# Altium schematic sheet DC_DC.SchDoc
size A3; Organization: Altium Limited; Address1: L3, 12a Rodborough Rd; Address2: Frenchs Forest; Address3: NSW; Address4: Australia 2086
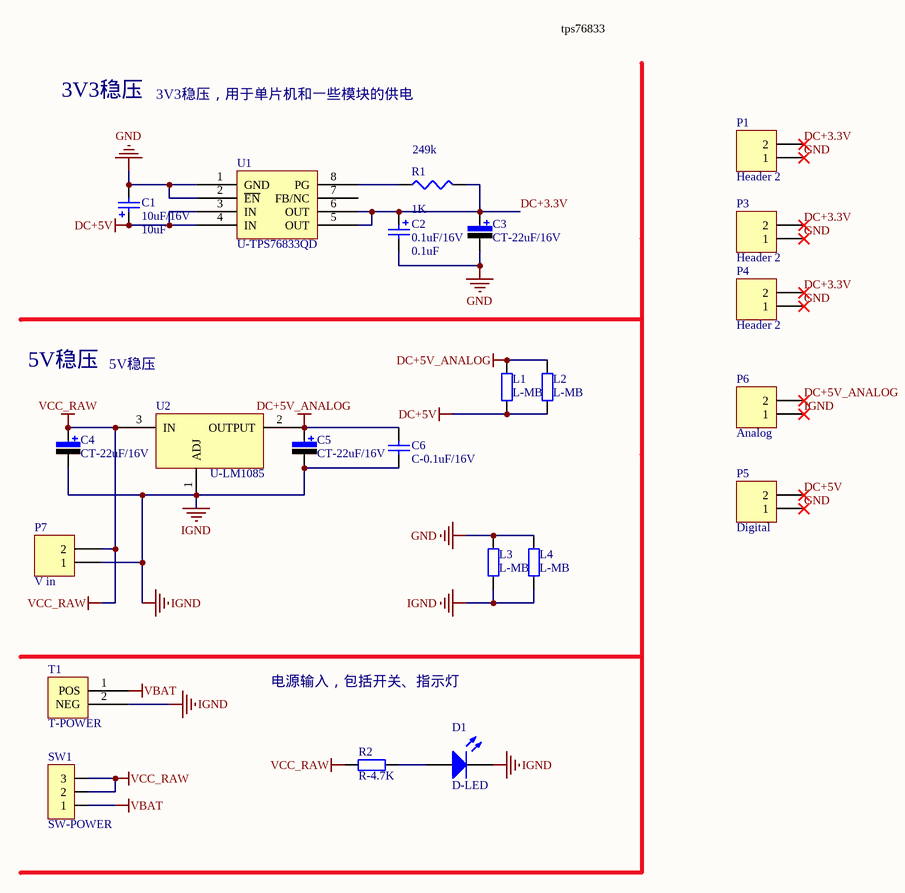
[diagram p0: DC_DC.SchDoc]

## Parts
C1  10uF/16V  value 10uF  [CAP-1206]
C2  0.1uF/16V  value 0.1uF  [CAP-1206]
C3  CT-22uF/16V  [CAP-3528]
C4  CT-22uF/16V  [CAP-3528]
C5  CT-22uF/16V  [CAP-3528]
C6  C-0.1uF/16V  [0603-1]
D1  D-LED  [0603-1]
L1  L-MB  [0603-1]
L2  L-MB  [0603-1]
L3  L-MB  [0603-1]
L4  L-MB  [0603-1]
P1  Header 2  [HDR1X2]
P3  Header 2  [HDR1X2]
P4  Header 2  [HDR1X2]
P5  Digital  [HDR1X2]
P6  Analog  [HDR1X2]
P7  V in  [HDR1X2]
R1  249k  value 1K  [0603-1]
R2  R-4.7K  [0603-1]
SW1  SW-POWER  [SWITCH_A4]
T1  T-POWER  [PWR_HDR]
U1  U-TPS76833QD  [SOIC8]
U2  U-LM1085  [TO263-3]

## Nets
DC+5V: C1.1 L1.1 L2.1 P5.2 U1.3(IN) U1.4(IN)
DC+5V_ANALOG: C5.1 C6.2 L1.2 L2.2 P6.2 U2.2(OUTPUT)
GND: C1.2 C2.2 C3.2 L3.1 L4.1 P1.1 P3.1 P4.1 P5.1 U1.1(GND) U1.2(~{EN})
IGND: C4.2 C5.2 C6.1 D1.2(K) L3.2 L4.2 P6.1 P7.1 T1.2(NEG) U2.1(ADJ)
VBAT: SW1.1 T1.1(POS)
VCC_RAW: C4.1 P7.2 R2.2 SW1.2 SW1.3 U2.3(IN)
DC+3.3V: C2.1 C3.1 P1.2 P3.2 P4.2 R1.2 U1.5(OUT) U1.6(OUT)
NetD1_1: D1.1(A) R2.1
NetR1_1: R1.1 U1.8(PG)

Not connected (* = marked no-connect by the designer): U1 7(FB/NC)

## Notes on the sheet
- tps76833
- 3V3稳压
- 3V3稳压，用于单片机和一些模块的供电
- 5V稳压
- 电源输入，包括开关、指示灯
- Title
- Size:
- Date:
- A3
- Number:
- Time:
- Revision:
- Sheet
- of
- File:

## Library data of the parts
C1 C2 = Cap Pol2: Polarized Capacitor (Axial); Published: 8-Jun-2000; LatestRevisionDate: 17-Jul-2002; LatestRevisionNote: Re-released for DXP Platform.; PackageReference: POLAR0.8; Publisher: Altium Limited; PackageDescription: Polarized Capacitor; 2 Leads
C3-C5 = Cap-Pol-A: 钽电容; Published: 8-Jun-2000; LatestRevisionDate: 17-Jul-2002; LatestRevisionNote: Re-released for DXP Platform.; PackageReference: RB7.6-15; Publisher: Altium Limited; Comment_1: Cap-Pol
C6 = Cap: Capacitor; Value: 100nF; Published: 8-Jun-2000; LatestRevisionDate: 17-Jul-2002; LatestRevisionNote: Re-released for DXP Platform.; PackageReference: RAD-0.3; Publisher: Altium Limited; PackageDescription: Radial Cap, Thru-Hole; 2 Leads; 0.3 in Pin Spacing
D1 = LED2: Typical RED, GREEN, YELLOW, AMBER GaAs LED; Published: 8-Jun-2000; LatestRevisionDate: 17-Jul-2002; LatestRevisionNote: Re-released for DXP Platform.; PackageVersion: Feb-2002; PackageReference: 3.2X1.6X1.1; Publisher: Altium Limited
L1-L4 = Res2: Resistor; Published: 8-Jun-2000; LatestRevisionDate: 17-Jul-2002; LatestRevisionNote: Re-released for DXP Platform.; PackageReference: AXIAL-0.4; Publisher: Altium Limited
P1 P3-P7 = Header 2: Header, 2-Pin; LatestRevisionDate: 17-Jul-2002; LatestRevisionNote: Re-released for DXP Platform.; Publisher: Altium Limited
R1 = Res3: Resistor; Published: 8-Jun-2000; LatestRevisionDate: 29-May-2009; LatestRevisionNote: IPC-7351 Footprint Added.; PackageReference: J1-0603; Publisher: Altium Limited; PackageDescription: Chip Resistor
R2 = Res2: Resistor; Value: 4K7; Published: 8-Jun-2000; LatestRevisionDate: 17-Jul-2002; LatestRevisionNote: Re-released for DXP Platform.; PackageReference: AXIAL-0.4; Publisher: Altium Limited; PackageDescription: Axial Device, Thru-Hole; 2 Leads; 0.4 in Pin Spacing
SW1 = 大三端电源开关
T1 = PWR_HDR
U1 = TPS76850
U2 = LM1085